# Altium schematic sheet dac.SchDoc: DAC
size A3; Author: wq; DrawnBy: wq; Organization: 合肥弗雷电子; Address1: 玉兰大道14号D栋3楼; Address2: 肥西县桃花镇; Address3: 合肥市; Address4: 安徽省; DocumentNumber: 1; Revision: betaV1.0; SheetNumber: 1; SheetTotal: 1
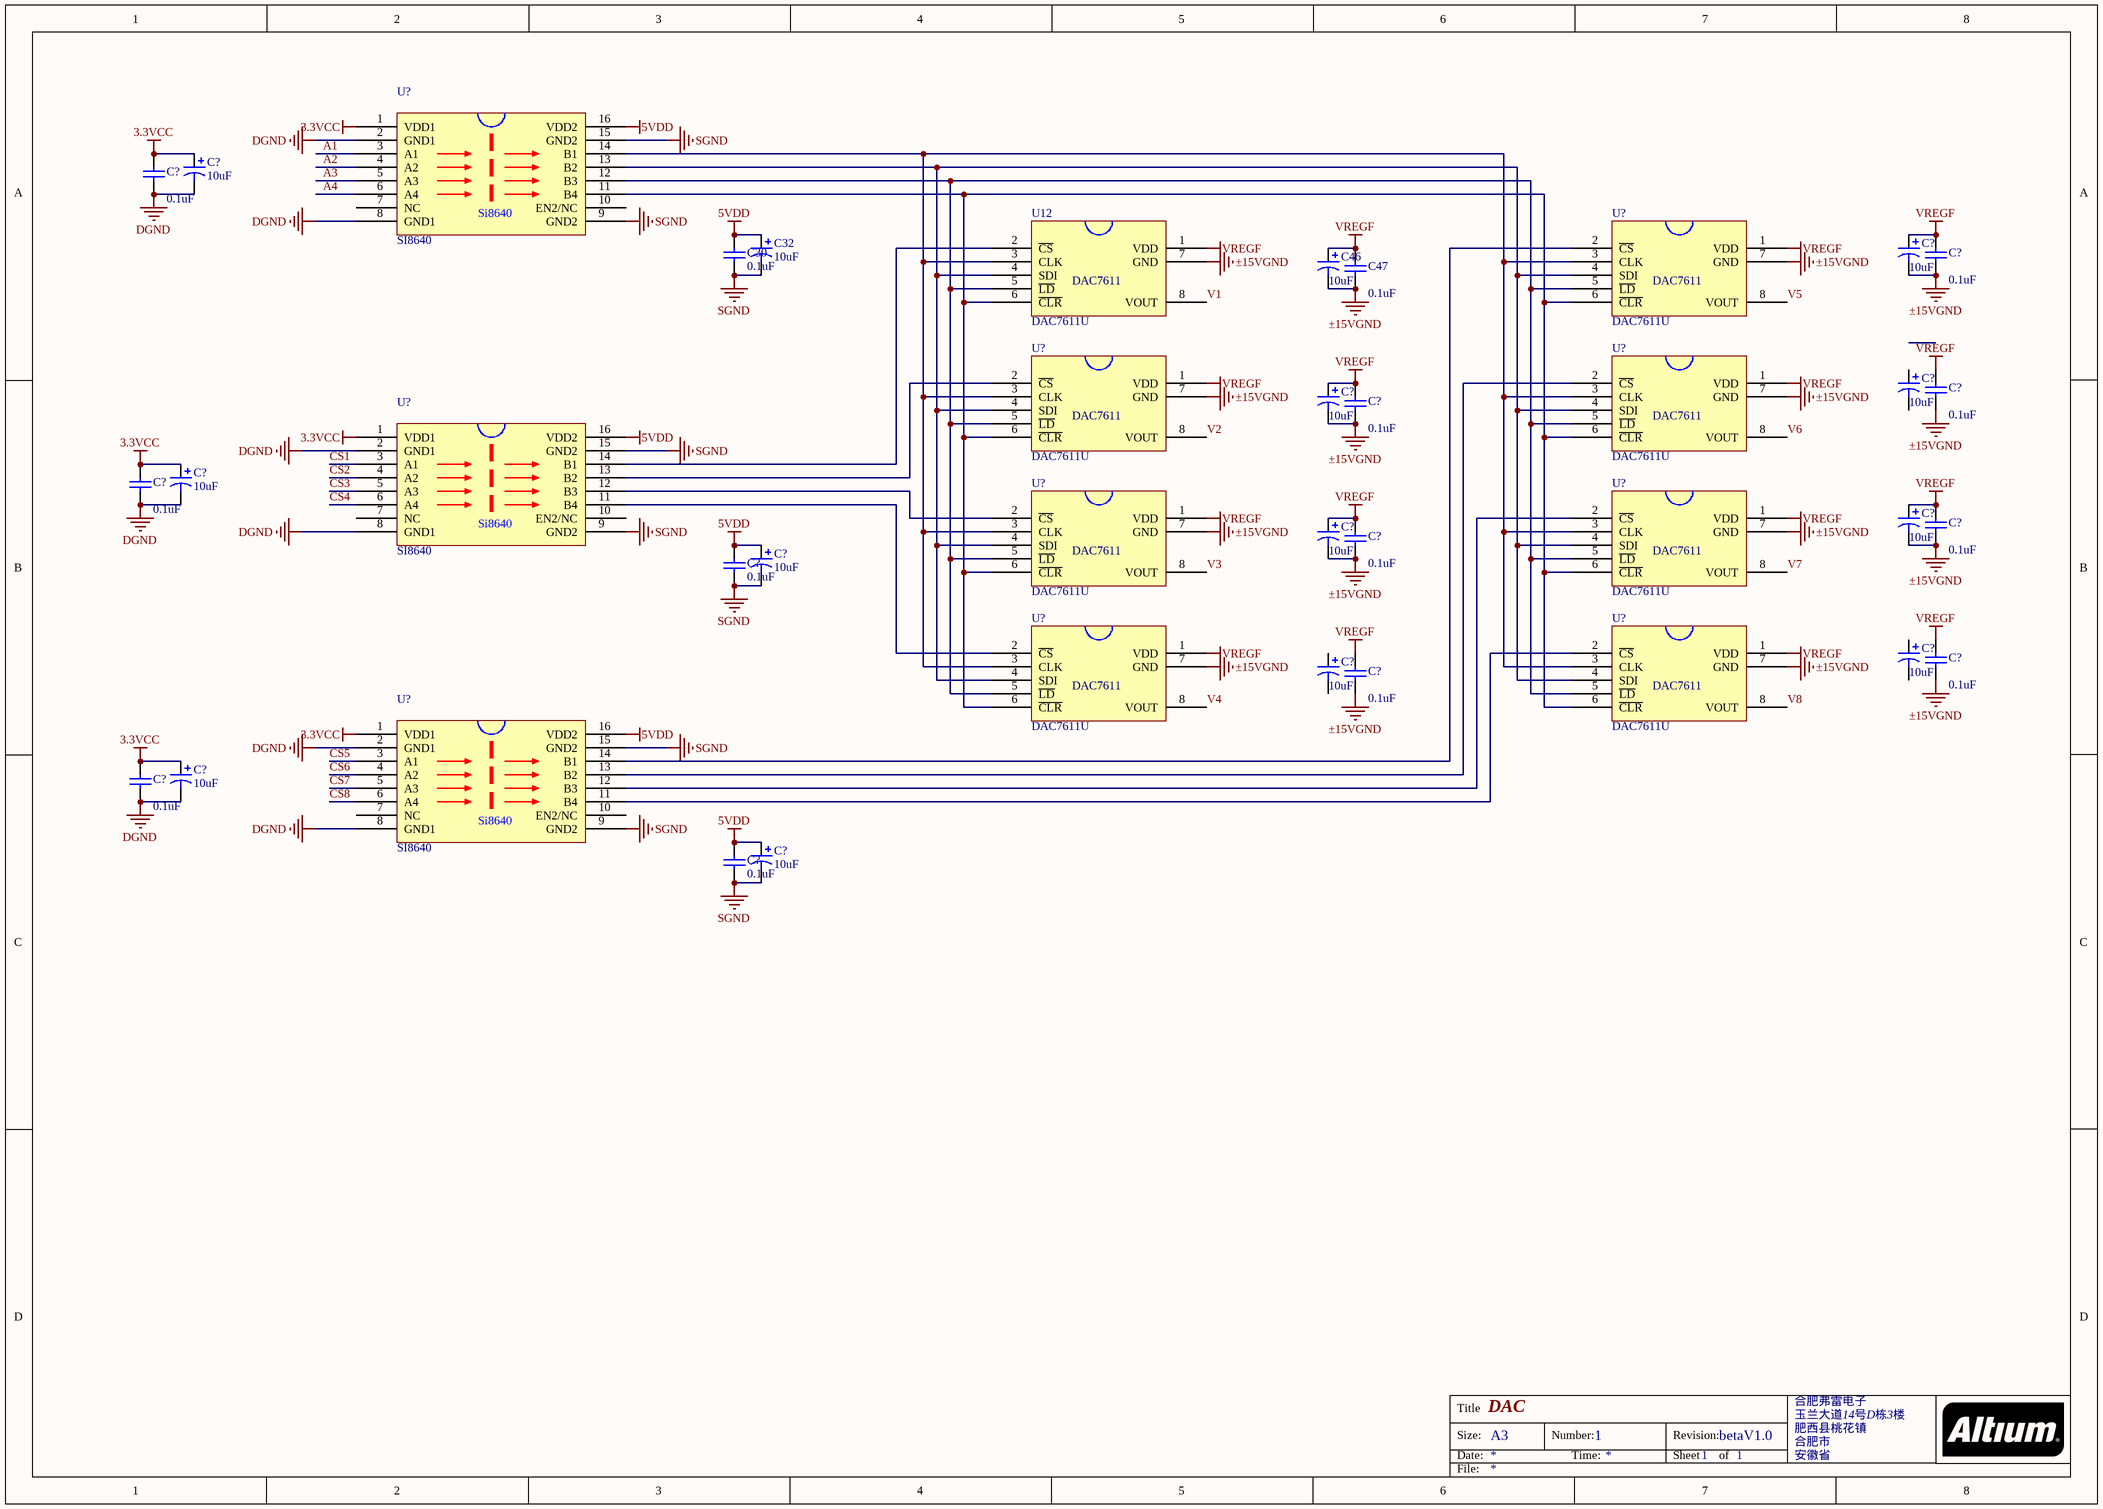
[diagram p0: dac.SchDoc]

## Parts
(Parts that share a designator on the sheet are numbered #1, #2 ... from top to bottom, then left to right.)
C30  value 0.1uF  [0805c]  (hidden comment: CC0805MRX7R9BB104)
C32  value 10uF  [CB]  (hidden comment: T494B106M006AHAUTO)
C46  value 10uF  [CB]  (hidden comment: T494B106M006AHAUTO)
C47  value 0.1uF  [0805c]  (hidden comment: CC0805MRX7R9BB104)
C?#1  value 0.1uF  [0805c]  (hidden comment: CC0805MRX7R9BB104)
C?#2  value 10uF  [CB]  (hidden comment: T494B106M006AHAUTO)
C?#3  value 10uF  [CB]  (hidden comment: T494B106M006AHAUTO)
C?#4  value 0.1uF  [0805c]  (hidden comment: CC0805MRX7R9BB104)
C?#5  value 10uF  [CB]  (hidden comment: T494B106M006AHAUTO)
C?#6  value 10uF  [CB]  (hidden comment: T494B106M006AHAUTO)
C?#7  value 0.1uF  [0805c]  (hidden comment: CC0805MRX7R9BB104)
C?#8  value 0.1uF  [0805c]  (hidden comment: CC0805MRX7R9BB104)
C?#9  value 0.1uF  [0805c]  (hidden comment: CC0805MRX7R9BB104)
C?#10  value 10uF  [CB]  (hidden comment: T494B106M006AHAUTO)
C?#11  value 10uF  [CB]  (hidden comment: T494B106M006AHAUTO)
C?#12  value 10uF  [CB]  (hidden comment: T494B106M006AHAUTO)
C?#13  value 0.1uF  [0805c]  (hidden comment: CC0805MRX7R9BB104)
C?#14  value 0.1uF  [0805c]  (hidden comment: CC0805MRX7R9BB104)
C?#15  value 0.1uF  [0805c]  (hidden comment: CC0805MRX7R9BB104)
C?#16  value 10uF  [CB]  (hidden comment: T494B106M006AHAUTO)
C?#17  value 10uF  [CB]  (hidden comment: T494B106M006AHAUTO)
C?#18  value 10uF  [CB]  (hidden comment: T494B106M006AHAUTO)
C?#19  value 0.1uF  [0805c]  (hidden comment: CC0805MRX7R9BB104)
C?#20  value 0.1uF  [0805c]  (hidden comment: CC0805MRX7R9BB104)
C?#21  value 0.1uF  [0805c]  (hidden comment: CC0805MRX7R9BB104)
C?#22  value 10uF  [CB]  (hidden comment: T494B106M006AHAUTO)
C?#23  value 0.1uF  [0805c]  (hidden comment: CC0805MRX7R9BB104)
C?#24  value 10uF  [CB]  (hidden comment: T494B106M006AHAUTO)
U12  DAC7611U  [so-8-n]
U?#1  SI8640
U?#2  DAC7611U  [so-8-n]
U?#3  DAC7611U  [so-8-n]
U?#4  DAC7611U  [so-8-n]
U?#5  SI8640
U?#6  DAC7611U  [so-8-n]
U?#7  DAC7611U  [so-8-n]
U?#8  DAC7611U  [so-8-n]
U?#9  DAC7611U  [so-8-n]
U?#10  SI8640

## Nets
3.3VCC: C?#1.1 C?#2.1 C?#9.1 C?#10.1 C?#21.1 C?#22.1 U?#1.1(VDD1) U?#5.1(VDD1) U?#10.1(VDD1)
5VDD: C30.1 C32.1 C?#15.1 C?#16.1 C?#23.1 C?#24.1 U?#1.16(VDD2) U?#5.16(VDD2) U?#10.16(VDD2)
DGND: C?#1.2 C?#2.2 C?#9.2 C?#10.2 C?#21.2 C?#22.2 U?#1.2(GND1) U?#1.8(GND1) U?#5.2(GND1) U?#5.8(GND1) U?#10.2(GND1) U?#10.8(GND1)
SGND: C30.2 C32.2 C?#15.2 C?#16.2 C?#23.2 C?#24.2 U?#1.9(GND2) U?#1.15(GND2) U?#5.9(GND2) U?#5.15(GND2) U?#10.9(GND2) U?#10.15(GND2)
VREGF: C46.1 C47.2 C?#3.1 C?#4.2 C?#6.1 C?#7.2 C?#8.2 C?#11.1 C?#12.1 C?#13.2 C?#14.2 C?#19.2 C?#20.2 U12.1(VDD) U?#2.1(VDD) U?#3.1(VDD) U?#4.1(VDD) U?#6.1(VDD) U?#7.1(VDD) U?#8.1(VDD) U?#9.1(VDD)
±15VGND: C46.2 C47.1 C?#3.2 C?#4.1 C?#6.2 C?#7.1 C?#8.1 C?#11.2 C?#12.2 C?#13.1 C?#14.1 C?#19.1 C?#20.1 U12.7(GND) U?#2.7(GND) U?#3.7(GND) U?#4.7(GND) U?#6.7(GND) U?#7.7(GND) U?#8.7(GND) U?#9.7(GND)
A1: U?#1.3(A1)
A2: U?#1.4(A2)
A3: U?#1.5(A3)
A4: U?#1.6(A4)
CS1: U?#5.3(A1)
CS2: U?#5.4(A2)
CS3: U?#5.5(A3)
CS4: U?#5.6(A4)
CS5: U?#10.3(A1)
CS6: U?#10.4(A2)
CS7: U?#10.5(A3)
CS8: U?#10.6(A4)
V1: U12.8(VOUT)
V2: U?#3.8(VOUT)
V3: U?#6.8(VOUT)
V4: U?#8.8(VOUT)
V5: U?#2.8(VOUT)
V6: U?#4.8(VOUT)
V7: U?#7.8(VOUT)
V8: U?#9.8(VOUT)
NetU12_2: U12.2(~{CS}) U?#5.14(B1)
NetU12_3: U12.3(CLK) U?#1.14(B1) U?#2.3(CLK) U?#3.3(CLK) U?#4.3(CLK) U?#6.3(CLK) U?#7.3(CLK) U?#8.3(CLK) U?#9.3(CLK)
NetU12_4: U12.4(SDI) U?#1.13(B2) U?#2.4(SDI) U?#3.4(SDI) U?#4.4(SDI) U?#6.4(SDI) U?#7.4(SDI) U?#8.4(SDI) U?#9.4(SDI)
NetU12_5: U12.5(~{LD}) U?#1.12(B3) U?#2.5(~{LD}) U?#3.5(~{LD}) U?#4.5(~{LD}) U?#6.5(~{LD}) U?#7.5(~{LD}) U?#8.5(~{LD}) U?#9.5(~{LD})
NetU12_6: U12.6(~{CLR}) U?#1.11(B4) U?#2.6(~{CLR}) U?#3.6(~{CLR}) U?#4.6(~{CLR}) U?#6.6(~{CLR}) U?#7.6(~{CLR}) U?#8.6(~{CLR}) U?#9.6(~{CLR})
NetU?#2_2: U?#2.2(~{CS}) U?#10.14(B1)
NetU?#3_2: U?#3.2(~{CS}) U?#5.13(B2)
NetU?#4_2: U?#4.2(~{CS}) U?#10.13(B2)
NetU?#5_11: U?#5.11(B4) U?#8.2(~{CS})
NetU?#5_12: U?#5.12(B3) U?#6.2(~{CS})
NetU?#7_2: U?#7.2(~{CS}) U?#10.12(B3)
NetU?#9_2: U?#9.2(~{CS}) U?#10.11(B4)

Not connected (* = marked no-connect by the designer): C?#5 1 2; C?#17 1 2; C?#18 1 2; U?#1 7(NC) 10(EN2/NC); U?#5 7(NC) 10(EN2/NC); U?#10 7(NC) 10(EN2/NC)

## Notes on the sheet
- Title
- Size:
- Date:
- A3
- Number:
- Time:
- Revision:
- Sheet
- of
- File:
- (in symbol SI8640) Si8640

## Library data of the parts
C30 C47 C?#1 C?#4 C?#7-C?#9 C?#13-C?#15 C?#19-C?#21 C?#23 = Cap: Capacitor
  C30 C47 C?#4 C?#7 C?#8 C?#13-C?#15 C?#19 C?#20 C?#23: Published: 8-Jun-2000; LatestRevisionDate: 17-Jul-2002; LatestRevisionNote: Re-released for DXP Platform.; PackageReference: RAD-0.3; Publisher: Altium Limited; PackageDescription: Radial Cap, Thru-Hole; 2 Leads; 0.3 in Pin Spacing
C32 C46 C?#2 C?#3 C?#5 C?#6 C?#10-C?#12 C?#16-C?#18 C?#22 C?#24 = Cap Pol1: Polarized Capacitor (Radial); Published: 8-Jun-2000; LatestRevisionDate: 17-Jul-2002; LatestRevisionNote: Re-released for DXP Platform.; PackageReference: RB7.6-15; Publisher: Altium Limited; PackageDescription: Polarized Capacitor (Radial); 2 Leads
U12 U?#2-U?#4 U?#6-U?#9 = DAC7611